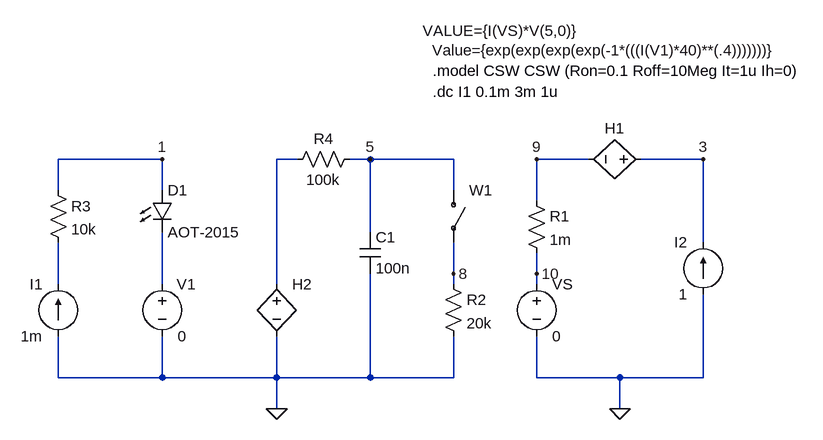
[diagram p0: schematic photoresistor.asc]
photoresistor.asc, the LTspice schematic file:
Version 4
SHEET 1 880 680
WIRE -64 -32 -224 -32
WIRE 144 -32 112 -32
WIRE 256 -32 224 -32
WIRE 384 -32 256 -32
WIRE 592 -32 512 -32
WIRE 768 -32 672 -32
WIRE -224 16 -224 -32
WIRE -64 16 -64 -32
WIRE 384 16 384 -32
WIRE 512 32 512 -32
WIRE 256 80 256 -32
WIRE 768 96 768 -32
WIRE 384 144 384 96
WIRE 512 144 512 112
WIRE -224 160 -224 96
WIRE -64 160 -64 80
WIRE 112 160 112 -32
WIRE 384 160 384 144
WIRE 512 160 512 144
WIRE -224 304 -224 240
WIRE -64 304 -64 240
WIRE -64 304 -224 304
WIRE 112 304 112 240
WIRE 112 304 -64 304
WIRE 256 304 256 144
WIRE 256 304 112 304
WIRE 384 304 384 240
WIRE 384 304 256 304
WIRE 512 304 512 240
WIRE 640 304 512 304
WIRE 768 304 768 176
WIRE 768 304 640 304
WIRE 112 352 112 304
WIRE 640 352 640 304
FLAG -64 -32 1
FLAG 768 -32 3
FLAG 112 352 0
FLAG 640 352 0
FLAG 256 -32 5
FLAG 512 -32 9
FLAG 512 144 10
FLAG 384 144 8
SYMBOL LED -80 16 R0
SYMATTR InstName D1
SYMATTR Value AOT-2015
SYMATTR Description Diode
SYMATTR Type diode
SYMBOL voltage 512 144 R0
SYMATTR InstName VS
SYMATTR Value 0
SYMBOL res 496 16 R0
SYMATTR InstName R1
SYMATTR Value 1m
SYMBOL current -224 240 R180
WINDOW 0 24 80 Left 2
WINDOW 3 24 0 Left 2
WINDOW 123 0 0 Left 0
WINDOW 39 0 0 Left 0
SYMATTR InstName I1
SYMATTR Value 1m
SYMBOL current 768 176 R180
WINDOW 0 24 80 Left 2
WINDOW 3 24 0 Left 2
SYMATTR InstName I2
SYMATTR Value 1
SYMBOL voltage -64 144 R0
WINDOW 0 37 16 Center 2
SYMATTR InstName V1
SYMATTR Value 0
SYMBOL cap 240 80 R0
SYMATTR InstName C1
SYMATTR Value 100n
SYMBOL res 368 144 R0
SYMATTR InstName R2
SYMATTR Value 20k
SYMBOL res -240 0 R0
SYMATTR InstName R3
SYMATTR Value 10k
SYMBOL res 240 -48 R90
WINDOW 0 0 56 VBottom 2
WINDOW 3 32 56 VTop 2
SYMATTR InstName R4
SYMATTR Value 100k
SYMBOL csw 384 16 R0
WINDOW 3 24 28 Invisible 2
SYMATTR InstName W1
SYMATTR Value VS CSW
SYMBOL h 688 -32 R90
WINDOW 0 -32 56 VBottom 2
WINDOW 3 -213 232 VTop 2
SYMATTR InstName H1
SYMATTR Value VALUE={I(VS)*V(5,0)}
SYMBOL h 112 144 R0
WINDOW 3 239 -344 Left 2
SYMATTR InstName H2
SYMATTR Value Value={exp(exp(exp(exp(-1*(((I(V1)*40)**(.4)))))))}
TEXT 352 -168 Left 2 !.model CSW CSW (Ron=0.1 Roff=10Meg It=1u Ih=0)
TEXT 352 -136 Left 2 !.dc I1 0.1m 3m 1u

The netlist it stands for:
* photoresistor.asc
D1 1 N003 AOT-2015
VS 10 0 0
R1 9 10 1m
I1 0 N002 1m
I2 0 3 1
V1 N003 0 0
C1 5 0 100n
R2 8 0 20k
R3 1 N002 10k
R4 5 N001 100k
W1 5 8 VS CSW
H1 3 9 VALUE={I(VS)*V(5,0)}
H2 N001 0 Value={exp(exp(exp(exp(-1*(((I(V1)*40)**(.4)))))))}
.model D D
.lib standard.dio
.model CSW CSW (Ron=0.1 Roff=10Meg It=1u Ih=0)
.dc I1 0.1m 3m 1u
.backanno
.end